# EAGLE design RGB (EAGLE 7.1.0)
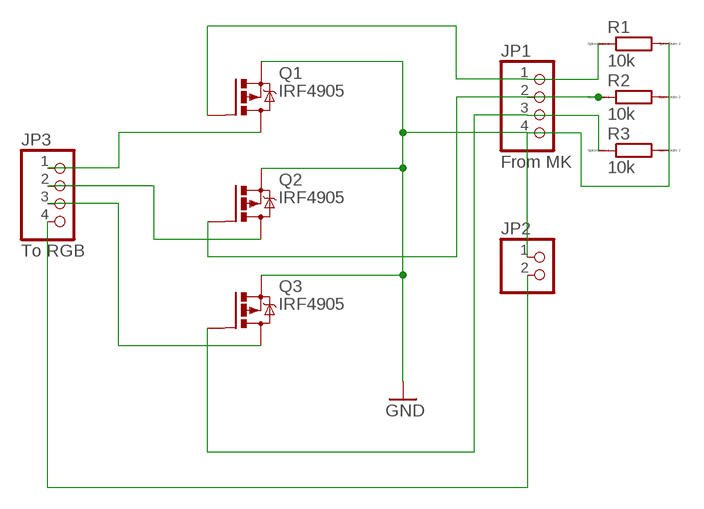
[diagram p0: schematic, sheet 1]

## Parts
JP1  From MK  PINHD-1X4/90  [1X04/90]
JP2  PINHD-1X2/90  [1X02/90]
JP3  To RGB  PINHD-1X4/90  [1X04/90]
Q1  IRF4905  [TO220BH]
Q2  IRF4905  [TO220BH]
Q3  IRF4905  [TO220BH]
R1  10k  R0207/10  [0207/10]
R2  10k  R0207/10  [0207/10]
R3  10k  R0207/10  [0207/10]

## Nets
GND: JP1.4 JP2.1 Q1.S Q2.S Q3.S R1.2 R2.2 R3.2
N$1: JP3.2 Q2.D
N$2: JP3.3 Q3.D
N$3: JP3.1 Q1.D
N$4: JP2.2 JP3.4
N$5: JP1.1 Q1.G R1.1
N$6: JP1.2 Q2.G R2.1
N$9: JP1.3 Q3.G R3.1

## Library data of the parts
JP1 JP3 = pinhead:PINHD-1X4: PIN HEADER
JP2 = pinhead:PINHD-1X2: PIN HEADER
Q1-Q3 = transistor-power:IRF4905: P-Channel HEXFET® Power MOSFET RDS(on)= 0.02 Ohm, ID = -74A Source: http://www.irf.com/product-info/datasheets/data/irf4905pbf.pdf
R1-R3 = eagle-ltspice:R: RESISTOR, European symbol; SPICEMODEL: NONE; SPICEPREFIX: R

## Board
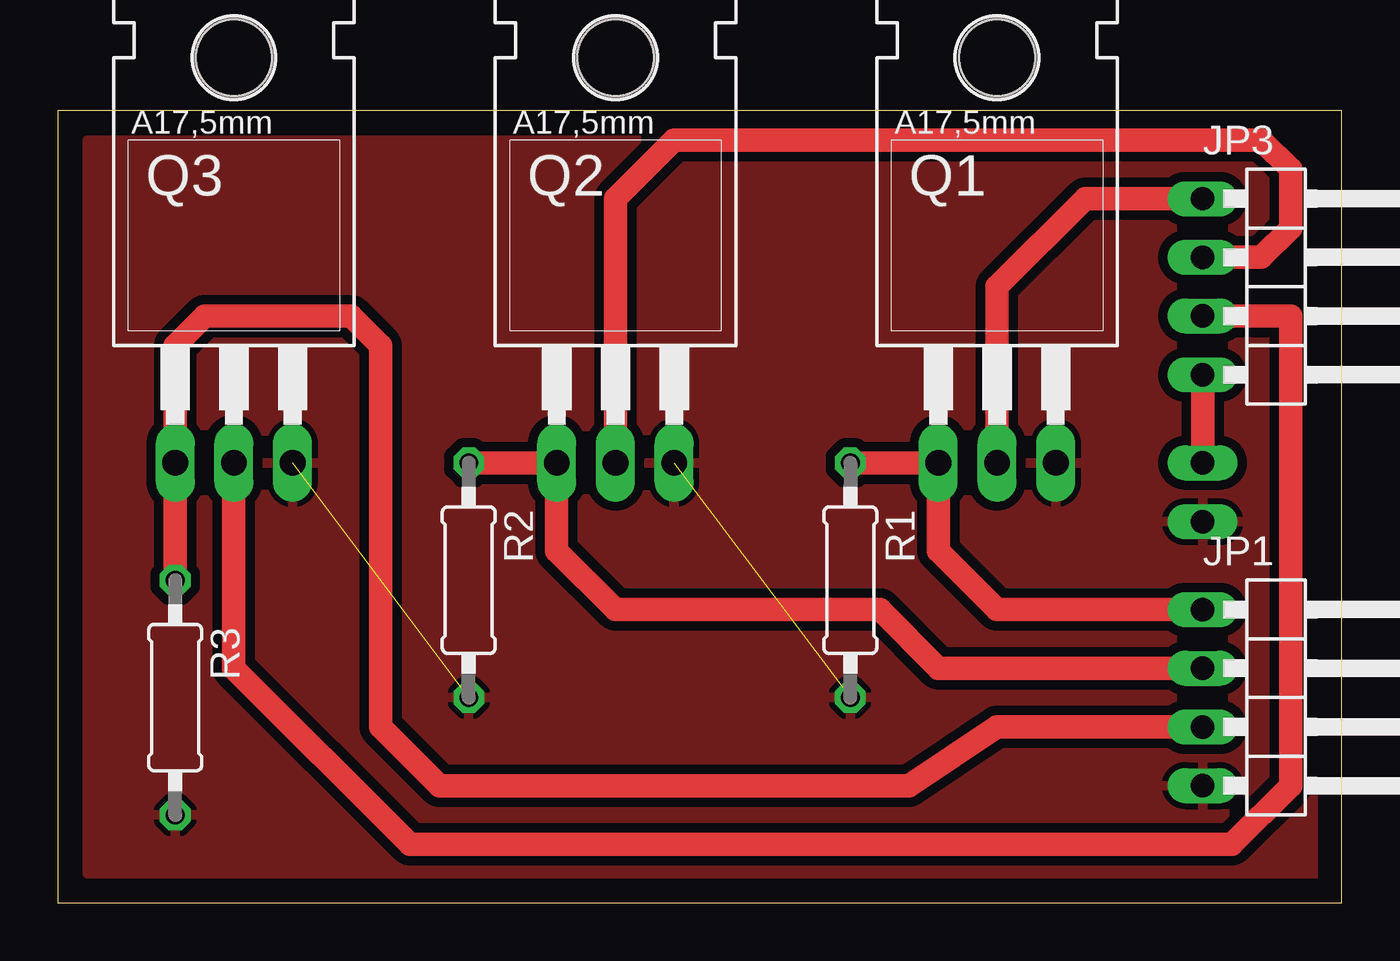
[diagram p1: board, top side]
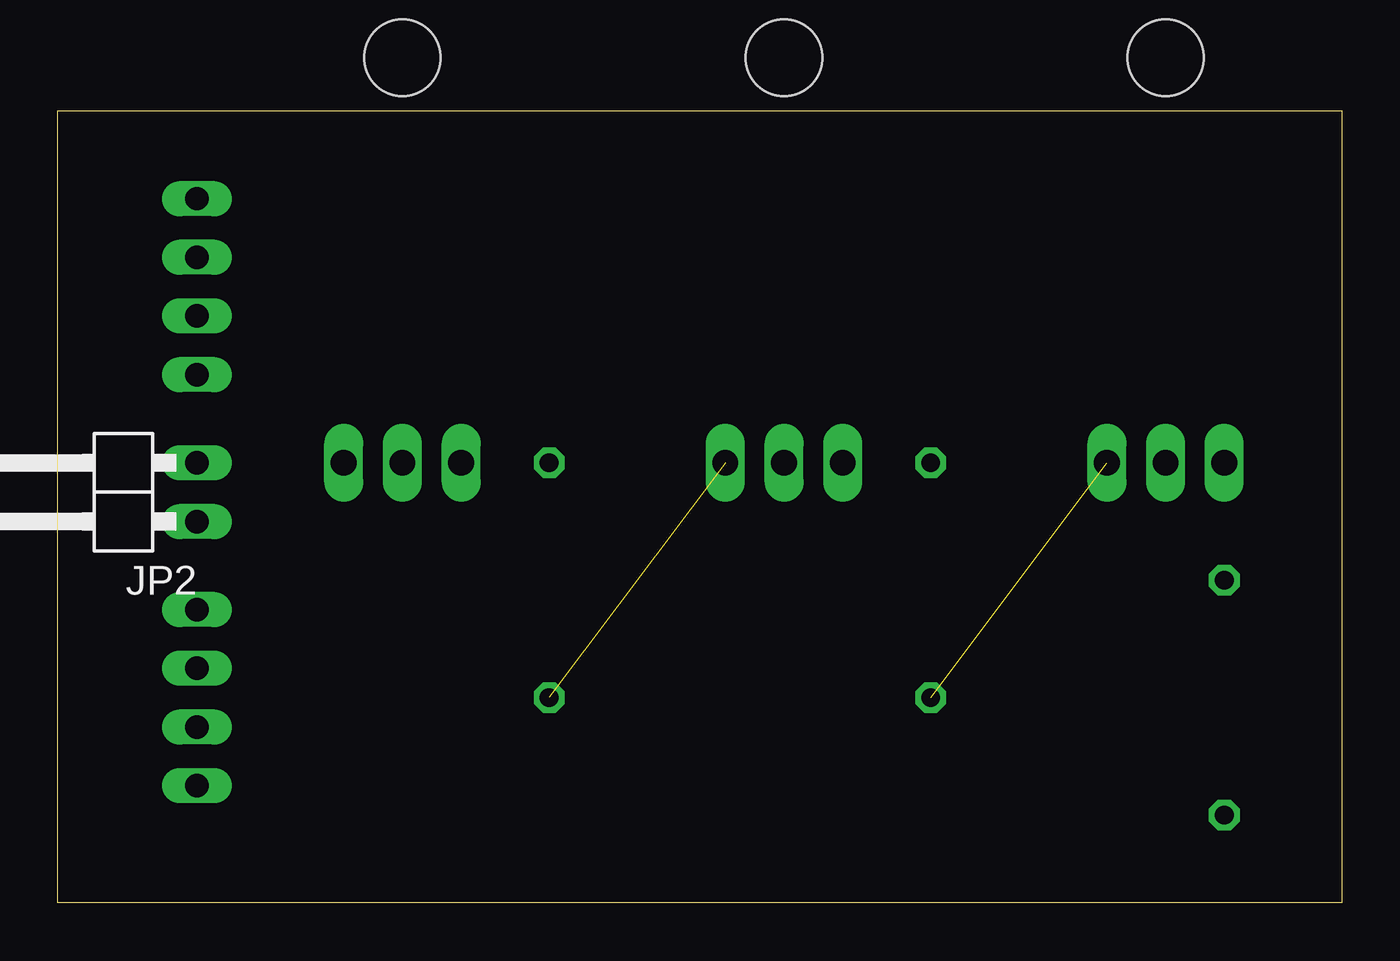
[diagram p2: board, bottom side, seen from below]

Size 55.55 x 34.28 mm. Coordinates in mm from the lower left corner, seen from the top.
Outline: 0,0 55.55,0 55.55,34.28 0,34.28 0,0
Copper layers (1*16): Top 0.035mm / dielectric 1.5mm / Bottom 0.035mm
Design rules "default": minimum track width 10mil, minimum drill 24mil, track to track 8mil, track to pad 8mil, pad to pad 8mil, via to via 8mil, smd to smd 8mil, copper to edge 40mil, drill to drill 8mil, minimum pad ring 10mil, minimum via ring 8mil, stop-mask expansion 4mil, vias tented up to drill 0mil, thermal gap 10mil

### Footprints (pad centres in the part's own frame; a part is rotated, then mirrored left to right if it is on the bottom)
1X04/90 = drill 1.016 long: 1 -3.81,-3.81; 2 -1.27,-3.81; 3 1.27,-3.81; 4 3.81,-3.81
1X02/90 = drill 1.016 long: 1 -1.27,-3.81; 2 1.27,-3.81
TO220BH = drill 1.118 long: D 0,-6.35; G -2.54,-6.35; S 2.54,-6.35 | hole 3.302: 0,11.176
0207/10 = drill 0.813 octagon: 1 -5.08,0; 2 5.08,0

### Placement (x,y rotation side)
JP1  53.34,8.89 270 top
JP2  53.34,17.78 90 bottom
JP3  53.34,26.67 270 top
Q1  40.64,25.4 0 top
Q2  24.13,25.4 0 top
Q3  7.62,25.4 0 top
R1  34.29,13.97 270 top
R2  17.78,13.97 270 top
R3  5.08,8.89 270 top

### Tracks (layer width: path | path; a pad name or v marks a point on that pad's centre or on a via)
GND  (2 unrouted)
  pour Top (isolate 0.406): 1.27,33.02 54.61,33.02 54.61,1.27 1.27,1.27
N$1
  Top 1.016: JP3.2 52.07,27.94 53.34,29.21 53.34,31.75 52.07,33.02 26.67,33.02 24.13,30.48 Q2.D
N$2
  Top 1.016: JP3.3 53.34,25.4 53.34,5.08 50.8,2.54 15.24,2.54 7.62,10.16 Q3.D
N$3
  Top 1.016: JP3.1 44.45,30.48 40.64,26.67 Q1.D
N$4
  Top 1.016: JP2.2 JP3.4
N$5
  Top 1.016: R1.1 Q1.G 38.1,15.24 40.64,12.7 JP1.1
N$6
  Top 1.016: R2.1 Q2.G 21.59,15.24 24.13,12.7 35.56,12.7 38.1,10.16 JP1.2
N$9
  Top 1.016: R3.1 Q3.G 5.08,24.13 6.35,25.4 12.7,25.4 13.97,24.13 13.97,7.62 16.51,5.08 36.83,5.08 40.64,7.62 JP1.3